# Altium schematic sheet pilotage moteur.SchDoc
size A4; SheetNumber: 1; SheetTotal: 1; SPICEModelCacheAKOKPCNQ: <root> / <DocumentId>AKOKPCNQ</DocumentId> / <CacheFrame Number="0"> / <Model Name="cap" Kind="MDL"> / <Text>*Default semiconductor capacitor / .MODEL CAP C()</Text> / </Model> / <Model Name="irf1010" Kind="CKT"> / <Text>*IRF1010 MCE 4-2-96 / *55V  75A .014 ohm HEXFET pkg:TO-220 2,1,3 / .SUBCKT IRF1010  10 20 40 40 / M1   1  2  3  3  DMOS L=1U W=1U / RD  10  1  5.65M / RS  30  3  1.35M / RG  20  2  12.1 / CGS  2  3  2.15N / EGD 12  0  2  1  1 / VFB 14  0  0 / FFB  2  1  VFB  1 / CGD 13 14  4.49N / R1  13  0  1 / D1  12 13  DLIM / DDG 15 14  DCGD / R2  12 15  1 / D2  15  0  DLIM / DSD  3 10  DSUB / LS  30 40  7.5N / .MODEL DMOS NMOS (LEVEL=3 THETA=60M VMAX=114K ETA=2M VTO=3 KP=19.4) / .MODEL DCGD D (CJO=4.49N VJ=.6 M=.68) / .MODEL DSUB D (IS=311N N=1.5 RS=8.67M BV=55 CJO=4.08N VJ=.8 M=.42 TT=100N) / .MODEL DLIM D (IS=100U) / .ENDS IRF1010</Text> / </Model> / </CacheFrame> / </root>
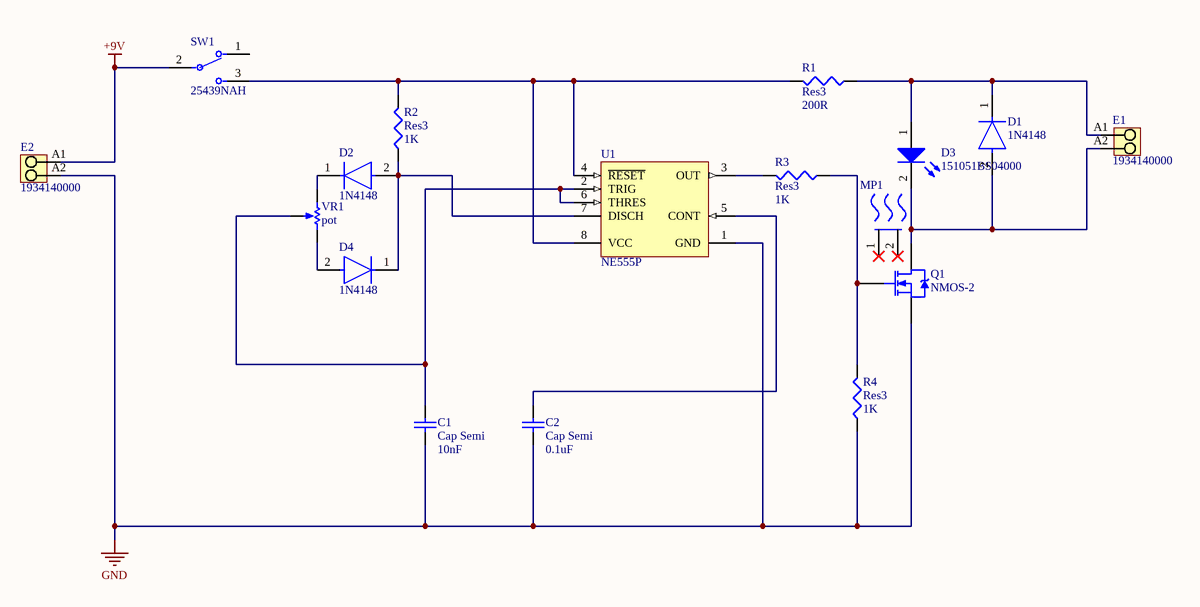
[diagram p0: pilotage moteur.SchDoc]

## Parts
C1  Cap Semi  value 10nF  [C1206]
C2  Cap Semi  value 0.1uF  [C1206]
D1  1N4148  [FP-017AG-MFG]
D2  1N4148  [FP-017AG-MFG]
D3  151051BS04000  [WL-TMRC_D5.9H8.7]
D4  1N4148  [FP-017AG-MFG]
E1  1934140000  [LU_10_16_90_02]
E2  1934140000  [LU_10_16_90_02]
MP1  E2A-T220-25E  [FP-E2A-T220-25E-MFG]  (value not drawn)
Q1  NMOS-2  [TO-220AB]
R1  Res3  value 200R  [J1-0603]
R2  Res3  value 1K  [J1-0603]
R3  Res3  value 1K  [J1-0603]
R4  Res3  value 1K  [J1-0603]
SW1  25439NAH  [FP-25439NAH-MFG]
U1  NE555P  [P0008A]
VR1  pot  [BOUR-3852A-282-103AL-3_V]

## Nets
+9V: E2.A1 SW1.2
GND: C1.1 C2.1 E2.A2 Q1.3(S) R4.1 U1.1(GND)
NetC1_2: C1.2 U1.2(TRIG) U1.6(THRES) VR1.2(S)
NetC2_2: C2.2 U1.5(CONT)
NetD1_1: D1.1(C) D3.1(A) E1.A1 R1.1
NetD1_2: D1.2(A) D3.2(K) E1.A2 Q1.2(D)
NetD2_1: D2.1(C) VR1.1(CCW)
NetD2_2: D2.2(A) D4.1(C) R2.1 U1.7(DISCH)
NetD4_2: D4.2(A) VR1.3(CW)
NetQ1_1: Q1.1(G) R3.1 R4.2
NetR1_2: R1.2 R2.2 SW1.3 U1.4(~{RESET}) U1.8(VCC)
NetR3_2: R3.2 U1.3(OUT)

Not connected (* = marked no-connect by the designer): MP1 1(MNT_1)* 2(MNT_2)*; SW1 1

## Library data of the parts
C1 C2 = Cap Semi: Capacitor (Semiconductor SIM Model); Published: 8-Jun-2000; LatestRevisionDate: 29-May-2009; LatestRevisionNote: IPC-7351 Footprint Added.; PackageReference: C1206; Publisher: Altium Limited; PackageDescription: Chip Capacitor
D1 D2 D4 = CMP-07163-000046-1: DIODE GEN PURP 100V 200MA DO35; Forward Voltage: 1V; Max Power Dissipation: 500mW; Max Reverse Current: 5uA; Forward Current: 300mA; Current: 4A; Reverse Recovery Time: 4ns; Element Configuration: Single; Outside Diameter: 1.85mm; Capacitance: 4pF; Polarity: Standard; Max Forward Surge Current (Ifsm): 1A; Reverse Voltage: 100V; Output Current: 200mA; Average Rectified Current: 200mA; Diameter: 1.91mm; Max Repetitive Reverse Voltage (Vrrm): 100V; Current Rating: 200mA; Case/Package: DO-35; Lead Free: Lead Free; Number of Pins: 2; Recovery Time: 4ns; Packaging: Bulk; Contact Plating: Tin; Voltage: 100V; Mount: Through Hole; Max Surge Current: 4A; Package Quantity: 2000; Width: 1.91mm; Max Reverse Voltage (DC): 100V; Length: 4.56mm; Radiation Hardening: No; Power Dissipation: 500mW; Voltage Rating (DC): 100V; Peak Non-Repetitive Surge Current: 4A; REACH SVHC: No SVHC; Height: 4.56mm; Max Operating Temperature: 175°C; Series: -; Weight: 0.01lb; Min Operating Temperature: -65°C
D3 = CMP-1488-00009-2: NexarPartId: 29717812; Test Current: 20mA; Forward Voltage: 3.2V; Wavelength: 470nm; Lens Size: 5mm; Lens Style: Circular, Diffused, Round; Forward Current: 100mA; Peak Wavelength: 465nm; Viewing Angle: 40°; Luminous Intensity: 500mcd; Max Reverse Voltage (DC): 5V; Color: Blue; Case/Package: Radial; Width: 5mm; Mount: Through Hole; Min Operating Temperature: -40°C; Length: 5mm; Height: 8.6mm; Max Operating Temperature: 85°C; Packaging: Bulk; RoHS: Compliant; REACH SVHC: Unknown; Dominant Wavelength: 470nm
E1 E2 = CMP-1560-00480-1: OMNIMATE Power - series LU; Manufacturer: Weidmueller; Solid_max_H05_07_V_U: 16 mm²; Wire_cross_section_AWG_max_UL_1059: AWG 6; Short_text_for_material: LU 10.16/02/90 4.5SN BK BX; Insulating_material: Wemid (PA); Solder_pin_length_mm: 4,5 mm; Side_termination_characteristic: closed side; Wire_cross_section_AWG_min_UL_1059: AWG 26; UL_94_flammability_rating: V-0; Rated_voltage_use_group_B_UL_1059: 300 V; Contact_material: E-Cu; No_of_poles: 2; Rated_voltage_for_surge_voltage_class_pollution_degree_II_2: 1000 V; Pitch_inch: 0,4 inch; Pitch_mm: 10,16 mm; Rated_current_use_group_B_UL_1059: 65 A; Solid_min_H05_07_V_U: 0,5 mm²; Mounting_onto_the_PCB: Solder connection; Contact_surface: tinned; Revision: V1; ComponentLink2Description: URL Link1; Packaging: Box; ComponentLink2URL: http://catalog.weidmueller.com/catalog/Start.do?localeId=en&ObjectID=1934140000; Colour: Black; PackageReference: LU_10_16_90_02; Qty: 20 PCS; ComponentLink1Description: Manufacturer URL; PartNumber: 1934140000; ComponentLink1URL: http://www.weidmueller.com/
MP1 = CMP-33535-000011-1: BLACK ANODIZED HEATSINK; Thermal Resistance @ Forced Air Flow (100 LFM): 4°C/W; Natural Thermal Resistance: 16.4°C/W; Package Cooled: TO-220; Shape: Fins; Mount: Bolt; RoHS Compliant: Yes; Material: Aluminium
Q1 = NMOS-2: N-Channel Power MOSFET; Note: Pin 2 is electrically connected to pin 4.; Published: 8-Jun-2000; LatestRevisionDate: 17-Jul-2002; LatestRevisionNote: Re-released for DXP Platform.; DatasheetVersion: PD-9.814; PackageVersion: Feb-1997; PackageReference: TO-220AB; Publisher: Altium Limited; PackageDescription: TO, Thru-Hole, Vertical, Heatsink Mounted; 3 In-Line Leads; Pitch 2.54 mm; ComponentLink1Description: Manufacturer Link; ComponentLink1URL: http://www.irf.com/
R1-R4 = Res3: Resistor; Published: 8-Jun-2000; LatestRevisionDate: 29-May-2009; LatestRevisionNote: IPC-7351 Footprint Added.; PackageReference: J1-0603; Publisher: Altium Limited; PackageDescription: Chip Resistor
SW1 = CMP-47022-000003-1: SWITCH SLIDE SPDT 4A 125V; Max Voltage Rating (AC): 250V; Contact Resistance: 10mR; Mechanical Life: 20000Cycles; Electrical Life: 10000Cycles; Voltage Rating (DC): 30V; Switch Travel: 4mm; Actuator Length: 2.8mm; Actuator Type: Standard; Current Rating: 1A; Actuator Material: Nylon; Switch Function: On-Off-On; Termination: PC Pin; Throw Configuration: SPDT; Series: 25000N; Contact Material: Silver; Voltage Rating (AC): 125V; Packaging: Bulk; Max Voltage Rating (DC): 30V; Orientation: Straight; REACH SVHC: No SVHC; RoHS Compliant: No; Package Quantity: 100; Mount: Through Hole; Max Operating Temperature: 85°C; Min Operating Temperature: -40°C
U1 = CMP-2000-04954-1: Precision Timer, 4.5 to 16 V, 0 to 70 degC, 8-Pin DIP, Pb-Free, Tube; Manufacturer: TexasInstruments; Maximum High Level Output Current: -200mA; Number of Internal Timers: 1; Operating Supply Voltage: 5; Maximum Low Level Output Current: 200mA; Rad Hard: No; Packaging: Rail/Tube; Manufacturer URL: http://www.ti.com/; Package Reference: P8; Package Description: 8-Pin Double In-line Package, Body 9.59 x 6.35 mm, Pitch 2.54 mm; Package URL: http://www.ti.com/lit/ml/mpdi001b/mpdi001b.pdf; Type: Standard; Datasheet URL: http://www.ti.com/general/docs/lit/getliterature.tsp?genericPartNumber=NE555&fileType=pdf; Category: Timer; Package: 8PDIP; Datasheet Version: Rev. I, 09/2014
VR1 = CMP-2000-05079-1: Diameter Panel Control, 10 KOhm, +/- 10%, 2 W, -1 to 125 degC, 3-Pin THD, RoHS, Bulk; Manufacturer: Bourns; Temperature Coefficient: ±150ppm/degC; Number of Gangs: 1; Other Names: 3852A282103AL; Actuator Length: 0.875"(22.23mm); Resistive Material: Cermet; PCN Design/Specification: PBTResinJun/2011; Rotation: 280deg; PCN Other: MultipleChanges01/Dec/2012; Catalog Drawings: 3852SeriesSide1 / 3852SeriesSide2; Online Catalog: 3852and3856Series; Associated Product: 36-8560-ND / -KNOBINSTRUMW/DIALRND.9"DIA / 36-8555-ND / -KNOBINSTRUMSKIRTEDRND.7"DIA / 36-8556-ND / -KNOBINSTRUMSKIRTEDRND.9"DIA / 36-8565-ND / -KNOBINSTRUMDBLBARRND.7"DIA / 36-8566-ND / -KNOBINSTRUMDBLBARRND.9"DIA / 36-8568-ND / -KNOBINSTRUMSGLBARRND.7"DIA / 36-8569-ND / -KNOBINSTRUMSGLBARRND.9"DIA / 36-8559-ND / -KNOBINSTRUMW/DIALRND.7"DIA / 226-1006-ND / -KNOBBLKGLOSS.75"DIA.250"SHAFT / 226-1007-ND / -KNOBBLKGLOSS.925"DIA.250"SHAFT / 226-1011-ND / -KNOBBLKGLOS; Actuator Diameter: 0.250"(6.35mm); Built in Switch: None; Resistance (Ohms): 100k; Power (Watts): 2W; Actuator Type: Slotted; Standard Package: 45; Tolerance: ±10%; Taper: Linear; Series: 3852; Packaging: Bulk; Category: Potentiometers,VariableResistors; Bushing Thread: 3/8-32; Datasheet URL: https://datasheet.ciiva.com/11831/0900766b80f93b4b-11831016.pdf; Datasheet Version: Sep-14; Number of Turns: 1; Family: RotaryPotentiometers,Rheostats; Termination Style: SolderLug; RoHS Information: 3852A-LMaterialDeclaration; Mounting Type: PanelMount; Manufacturer URL: http://www.bourns.com/